# EAGLE schematic cap (EAGLE 5.91)
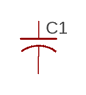
[diagram p0: schematic, sheet 1]

## Parts
C1  C-USC0805  (no package)
Unconnected: C1.1 C1.2

## Library data of the parts
C1 = cap:C-US: CAPACITOR, American symbol